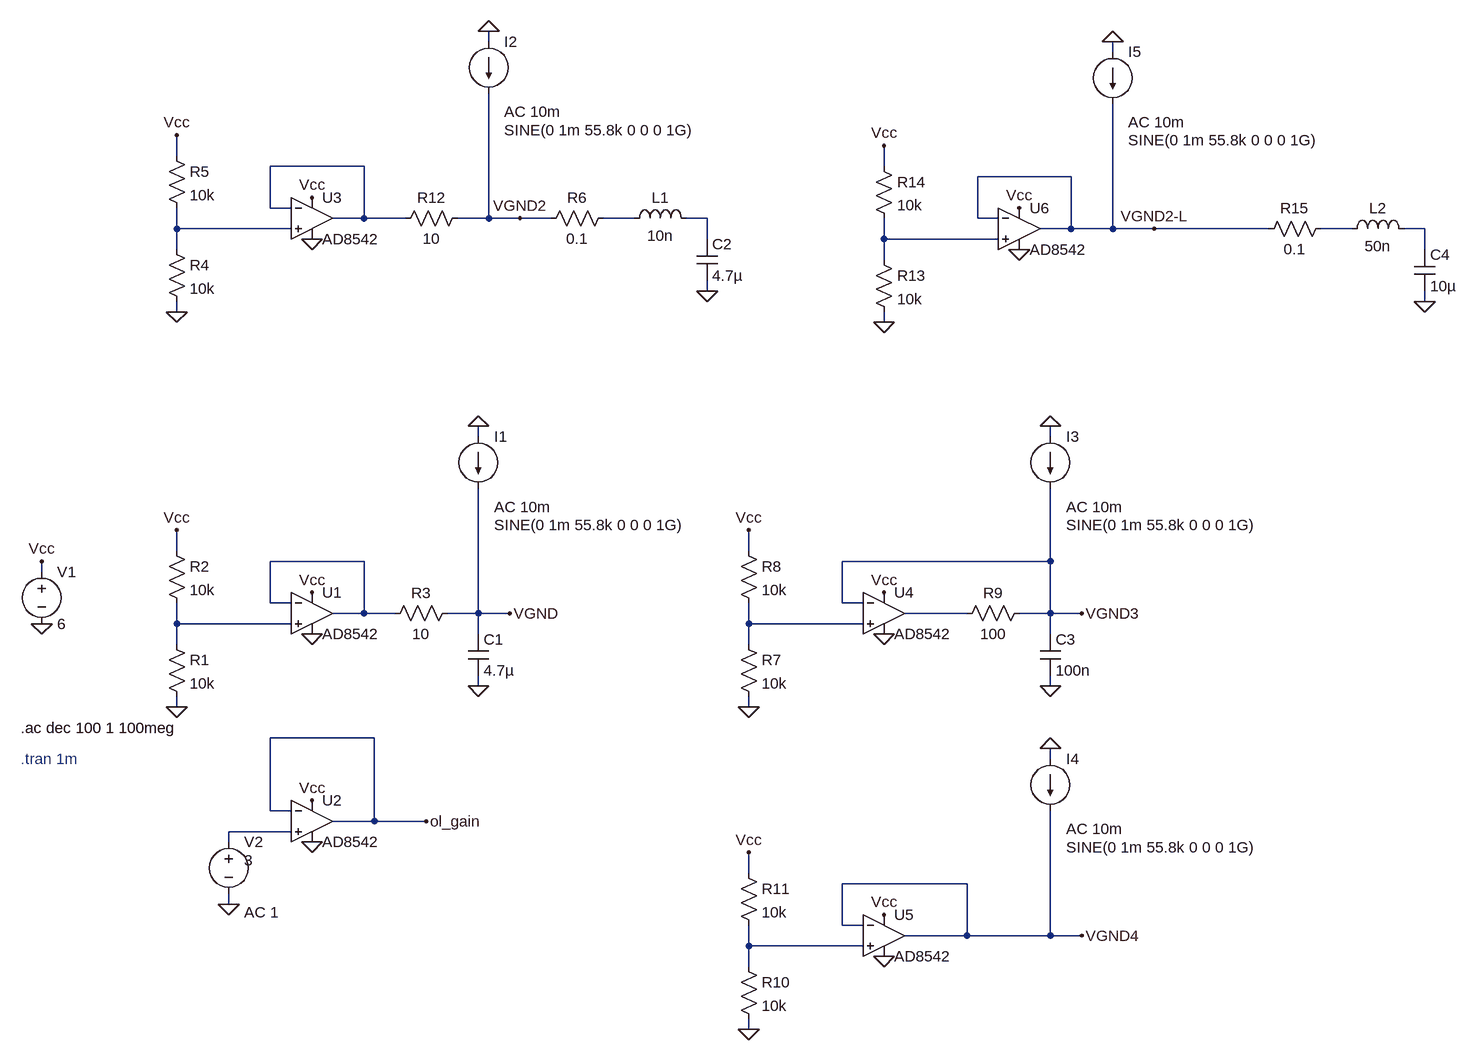
[diagram p0: schematic virtual_ground_ac_test.asc]
virtual_ground_ac_test.asc, the LTspice schematic file:
Version 4
SHEET 1 1952 788
WIRE 352 -752 352 -768
WIRE 1312 -736 1312 -752
WIRE -128 -576 -128 -608
WIRE 160 -560 16 -560
WIRE 960 -560 960 -592
WIRE 1248 -544 1104 -544
WIRE 16 -496 16 -560
WIRE 48 -496 16 -496
WIRE 160 -480 160 -560
WIRE 160 -480 112 -480
WIRE 224 -480 160 -480
WIRE 352 -480 352 -672
WIRE 352 -480 304 -480
WIRE 400 -480 352 -480
WIRE 448 -480 400 -480
WIRE 576 -480 528 -480
WIRE 688 -480 656 -480
WIRE 1104 -480 1104 -544
WIRE 1136 -480 1104 -480
WIRE -128 -464 -128 -496
WIRE 48 -464 -128 -464
WIRE 1248 -464 1248 -544
WIRE 1248 -464 1200 -464
WIRE 1312 -464 1312 -656
WIRE 1312 -464 1248 -464
WIRE 1376 -464 1312 -464
WIRE 1552 -464 1376 -464
WIRE 1680 -464 1632 -464
WIRE 1792 -464 1760 -464
WIRE 688 -448 688 -480
WIRE 960 -448 960 -480
WIRE 1136 -448 960 -448
WIRE -128 -432 -128 -464
WIRE 1792 -432 1792 -464
WIRE 960 -416 960 -448
WIRE 688 -368 688 -384
WIRE 1792 -352 1792 -368
WIRE -128 -336 -128 -352
WIRE 960 -320 960 -336
WIRE 336 -144 336 -160
WIRE 1216 -144 1216 -160
WIRE -128 32 -128 0
WIRE 752 32 752 0
WIRE 160 48 16 48
WIRE 1216 48 1216 -64
WIRE 1216 48 896 48
WIRE -336 64 -336 48
WIRE 16 112 16 48
WIRE 48 112 16 112
WIRE 896 112 896 48
WIRE 928 112 896 112
WIRE 160 128 160 48
WIRE 160 128 112 128
WIRE 208 128 160 128
WIRE 336 128 336 -64
WIRE 336 128 288 128
WIRE 384 128 336 128
WIRE 1088 128 992 128
WIRE 1216 128 1216 48
WIRE 1216 128 1168 128
WIRE 1264 128 1216 128
WIRE -128 144 -128 112
WIRE 48 144 -128 144
WIRE 752 144 752 112
WIRE 928 144 752 144
WIRE 336 160 336 128
WIRE 1216 160 1216 128
WIRE -128 176 -128 144
WIRE 752 176 752 144
WIRE 336 240 336 224
WIRE 1216 240 1216 224
WIRE -128 272 -128 256
WIRE 752 272 752 256
WIRE 176 320 16 320
WIRE 1216 352 1216 336
WIRE 16 432 16 320
WIRE 48 432 16 432
WIRE 176 448 176 320
WIRE 176 448 112 448
WIRE 256 448 176 448
WIRE 48 464 -48 464
WIRE -48 480 -48 464
WIRE 752 528 752 496
WIRE 1088 544 896 544
WIRE -48 576 -48 560
WIRE 896 608 896 544
WIRE 928 608 896 608
WIRE 1088 624 1088 544
WIRE 1088 624 992 624
WIRE 1216 624 1216 432
WIRE 1216 624 1088 624
WIRE 1264 624 1216 624
WIRE 752 640 752 608
WIRE 928 640 752 640
WIRE 752 672 752 640
WIRE 752 768 752 752
FLAG 80 96 Vcc
FLAG 80 160 0
FLAG 384 128 VGND
FLAG -336 48 Vcc
FLAG -336 144 0
FLAG 336 240 0
FLAG -128 272 0
FLAG -128 0 Vcc
FLAG 336 -160 0
FLAG 80 416 Vcc
FLAG 80 480 0
FLAG -48 576 0
FLAG 256 448 ol_gain
FLAG 80 -512 Vcc
FLAG 80 -448 0
FLAG 400 -480 VGND2
FLAG 688 -368 0
FLAG -128 -336 0
FLAG -128 -608 Vcc
FLAG 352 -768 0
FLAG 960 96 Vcc
FLAG 960 160 0
FLAG 1264 128 VGND3
FLAG 1216 240 0
FLAG 752 272 0
FLAG 752 0 Vcc
FLAG 1216 -160 0
FLAG 960 592 Vcc
FLAG 960 656 0
FLAG 1264 624 VGND4
FLAG 752 768 0
FLAG 752 496 Vcc
FLAG 1216 336 0
FLAG 1168 -496 Vcc
FLAG 1168 -432 0
FLAG 1792 -352 0
FLAG 960 -320 0
FLAG 960 -592 Vcc
FLAG 1312 -752 0
FLAG 1376 -464 VGND2-L
SYMBOL voltage -336 48 R0
WINDOW 123 0 0 Left 0
WINDOW 39 0 0 Left 0
SYMATTR InstName V1
SYMATTR Value 6
SYMBOL OpAmps\\AD8542 80 64 R0
SYMATTR InstName U1
SYMBOL cap 320 160 R0
SYMATTR InstName C1
SYMATTR Value 4.7µ
SYMBOL current 336 -144 R0
WINDOW 3 24 136 Left 2
WINDOW 123 24 108 Left 2
WINDOW 39 0 0 Left 0
SYMATTR Value SINE(0 1m 55.8k 0 0 0 1G)
SYMATTR Value2 AC 10m
SYMATTR InstName I1
SYMBOL res -144 160 R0
SYMATTR InstName R1
SYMATTR Value 10k
SYMBOL res -144 16 R0
SYMATTR InstName R2
SYMATTR Value 10k
SYMBOL res 304 112 R90
WINDOW 0 0 56 VBottom 2
WINDOW 3 32 56 VTop 2
SYMATTR InstName R3
SYMATTR Value 10
SYMBOL OpAmps\\AD8542 80 384 R0
SYMATTR InstName U2
SYMBOL voltage -48 464 R0
WINDOW 123 24 124 Left 2
WINDOW 39 0 0 Left 0
WINDOW 3 24 44 Left 2
SYMATTR Value2 AC 1
SYMATTR Value 3
SYMATTR InstName V2
SYMBOL OpAmps\\AD8542 80 -544 R0
SYMATTR InstName U3
SYMBOL current 352 -752 R0
WINDOW 3 24 136 Left 2
WINDOW 123 24 108 Left 2
WINDOW 39 0 0 Left 0
SYMATTR Value SINE(0 1m 55.8k 0 0 0 1G)
SYMATTR Value2 AC 10m
SYMATTR InstName I2
SYMBOL res -144 -448 R0
SYMATTR InstName R4
SYMATTR Value 10k
SYMBOL res -144 -592 R0
SYMATTR InstName R5
SYMATTR Value 10k
SYMBOL OpAmps\\AD8542 960 64 R0
SYMATTR InstName U4
SYMBOL current 1216 -144 R0
WINDOW 3 24 136 Left 2
WINDOW 123 24 108 Left 2
WINDOW 39 0 0 Left 0
SYMATTR Value SINE(0 1m 55.8k 0 0 0 1G)
SYMATTR Value2 AC 10m
SYMATTR InstName I3
SYMBOL res 736 160 R0
SYMATTR InstName R7
SYMATTR Value 10k
SYMBOL res 736 16 R0
SYMATTR InstName R8
SYMATTR Value 10k
SYMBOL res 1184 112 R90
WINDOW 0 0 56 VBottom 2
WINDOW 3 32 56 VTop 2
SYMATTR InstName R9
SYMATTR Value 100
SYMBOL cap 1200 160 R0
SYMATTR InstName C3
SYMATTR Value 100n
SYMBOL OpAmps\\AD8542 960 560 R0
SYMATTR InstName U5
SYMBOL current 1216 352 R0
WINDOW 3 24 136 Left 2
WINDOW 123 24 108 Left 2
WINDOW 39 0 0 Left 0
SYMATTR Value SINE(0 1m 55.8k 0 0 0 1G)
SYMATTR Value2 AC 10m
SYMATTR InstName I4
SYMBOL res 736 656 R0
SYMATTR InstName R10
SYMATTR Value 10k
SYMBOL res 736 512 R0
SYMATTR InstName R11
SYMATTR Value 10k
SYMBOL cap 672 -448 R0
SYMATTR InstName C2
SYMATTR Value 4.7µ
SYMBOL res 544 -496 R90
WINDOW 0 0 56 VBottom 2
WINDOW 3 32 56 VTop 2
SYMATTR InstName R6
SYMATTR Value 0.1
SYMBOL ind 560 -464 R270
WINDOW 0 32 56 VTop 2
WINDOW 3 5 56 VBottom 2
SYMATTR InstName L1
SYMATTR Value 10n
SYMBOL res 320 -496 R90
WINDOW 0 0 56 VBottom 2
WINDOW 3 32 56 VTop 2
SYMATTR InstName R12
SYMATTR Value 10
SYMBOL OpAmps\\AD8542 1168 -528 R0
SYMATTR InstName U6
SYMBOL current 1312 -736 R0
WINDOW 3 24 136 Left 2
WINDOW 123 24 108 Left 2
WINDOW 39 0 0 Left 0
SYMATTR Value SINE(0 1m 55.8k 0 0 0 1G)
SYMATTR Value2 AC 10m
SYMATTR InstName I5
SYMBOL res 944 -432 R0
SYMATTR InstName R13
SYMATTR Value 10k
SYMBOL res 944 -576 R0
SYMATTR InstName R14
SYMATTR Value 10k
SYMBOL cap 1776 -432 R0
SYMATTR InstName C4
SYMATTR Value 10µ
SYMBOL res 1648 -480 R90
WINDOW 0 0 56 VBottom 2
WINDOW 3 32 56 VTop 2
SYMATTR InstName R15
SYMATTR Value 0.1
SYMBOL ind 1664 -448 R270
WINDOW 0 32 56 VTop 2
WINDOW 3 5 56 VBottom 2
SYMATTR InstName L2
SYMATTR Value 50n
TEXT -368 304 Left 2 !.ac dec 100 1 100meg
TEXT -368 352 Left 2 ;.tran 1m

The netlist it stands for:
* virtual_ground_ac_test.asc
V1 Vcc 0 6
XU1 N010 N008 Vcc 0 N008 AD8542  ; pins In+ In- V+ V- OUT
C1 VGND 0 4.7µ
I1 0 VGND SINE(0 1m 55.8k 0 0 0 1G) AC 10m
R1 N010 0 10k
R2 Vcc N010 10k
R3 VGND N008 10
XU2 N012 ol_gain Vcc 0 ol_gain AD8542  ; pins In+ In- V+ V- OUT
V2 N012 0 3 AC 1
XU3 N004 N001 Vcc 0 N001 AD8542  ; pins In+ In- V+ V- OUT
I2 0 VGND2 SINE(0 1m 55.8k 0 0 0 1G) AC 10m
R4 N004 0 10k
R5 Vcc N004 10k
XU4 N011 VGND3 Vcc 0 N009 AD8542  ; pins In+ In- V+ V- OUT
I3 0 VGND3 SINE(0 1m 55.8k 0 0 0 1G) AC 10m
R7 N011 0 10k
R8 Vcc N011 10k
R9 VGND3 N009 100
C3 VGND3 0 100n
XU5 N013 VGND4 Vcc 0 VGND4 AD8542  ; pins In+ In- V+ V- OUT
I4 0 VGND4 SINE(0 1m 55.8k 0 0 0 1G) AC 10m
R10 N013 0 10k
R11 Vcc N013 10k
C2 N003 0 4.7µ
R6 N002 VGND2 0.1
L1 N002 N003 10n
R12 VGND2 N001 10
XU6 N007 VGND2-L Vcc 0 VGND2-L AD8542  ; pins In+ In- V+ V- OUT
I5 0 VGND2-L SINE(0 1m 55.8k 0 0 0 1G) AC 10m
R13 N007 0 10k
R14 Vcc N007 10k
C4 N006 0 10µ
R15 N005 VGND2-L 0.1
L2 N005 N006 50n
.ac dec 100 1 100meg
* .tran 1m
.lib AD8542.sub
.backanno
.end